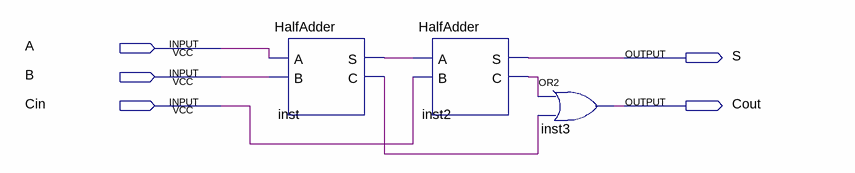
[diagram p0: schematic sheet]
// Quartus schematic FullAdder.bdf as structural Verilog: 3 symbols, 5 pins
module FullAdder (
  input  A,
  input  B,
  input  Cin,
  output S,
  output Cout
);

  wire inst2_c, inst_c, inst_s;

  HalfAdder inst (.A(A), .B(B), .S(inst_s), .C(inst_c));
  HalfAdder inst2 (.A(inst_s), .B(Cin), .S(S), .C(inst2_c));
  or inst3 (Cout, inst2_c, inst_c);
endmodule
